# EAGLE design Sequenzer (EAGLE 6.2)
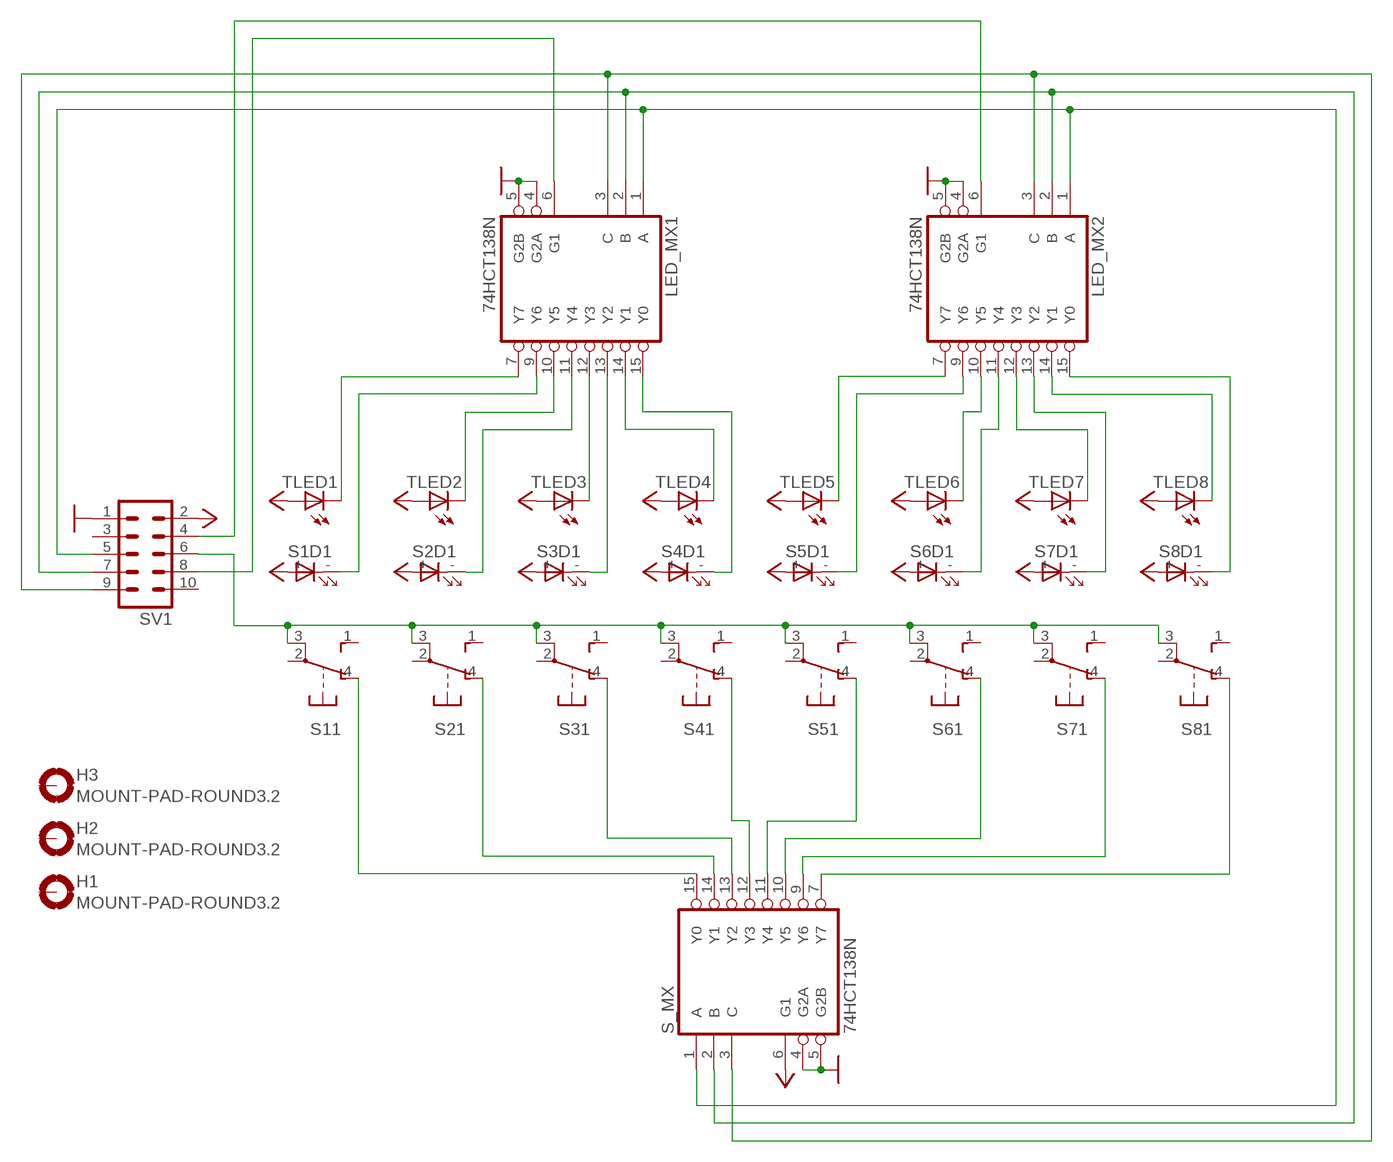
[diagram p0: schematic, sheet 1]

## Parts
H1  MOUNT-PAD-ROUND3.2  [3,2-PAD]
H2  MOUNT-PAD-ROUND3.2  [3,2-PAD]
H3  MOUNT-PAD-ROUND3.2  [3,2-PAD]
LED_MX1  74HCT138N  [DIL16]
LED_MX2  74HCT138N  [DIL16]
S1  SRKL  [SRKL]
S2  SRKL  [SRKL]
S3  SRKL  [SRKL]
S4  SRKL  [SRKL]
S5  SRKL  [SRKL]
S6  SRKL  [SRKL]
S7  SRKL  [SRKL]
S8  SRKL  [SRKL]
S_MX  74HCT138N  [DIL16]
SV1  ML10  [ML10]
TLED1  LED3MM  [LED3MM]
TLED2  LED3MM  [LED3MM]
TLED3  LED3MM  [LED3MM]
TLED4  LED3MM  [LED3MM]
TLED5  LED3MM  [LED3MM]
TLED6  LED3MM  [LED3MM]
TLED7  LED3MM  [LED3MM]
TLED8  LED3MM  [LED3MM]

## Nets
1: LED_MX1.1(A) LED_MX2.1(A) S_MX.1(A) SV1.5
2: LED_MX1.2(B) LED_MX2.2(B) S_MX.2(B) SV1.7
3: LED_MX1.3(C) LED_MX2.3(C) S_MX.3(C) SV1.9
GND: LED_MX1.4(G2A) LED_MX1.5(G2B) LED_MX2.4(G2A) LED_MX2.5(G2B) S_MX.4(G2A) S_MX.5(G2B) SV1.1
MX1EN: LED_MX1.6(G1) SV1.8
MX2EN: LED_MX2.6(G1) SV1.4
N$4: S8.4(1:O) S_MX.7(Y7)
N$5: S7.4(1:O) S_MX.9(Y6)
N$6: S6.4(1:O) S_MX.10(Y5)
N$7: S5.4(1:O) S_MX.11(Y4)
N$8: S4.4(1:O) S_MX.12(Y3)
N$9: S3.4(1:O) S_MX.13(Y2)
N$10: S2.4(1:O) S_MX.14(Y1)
N$11: S1.4(1:O) S_MX.15(Y0)
S_SENSE: S1.3(1:P) S2.3(1:P) S3.3(1:P) S4.3(1:P) S5.3(1:P) S6.3(1:P) S7.3(1:P) S8.3(1:P) SV1.6
SLED: LED_MX1.13(Y2) S3.-(D1:C)
SLED1: LED_MX1.9(Y6) S1.-(D1:C)
SLED2: LED_MX1.11(Y4) S2.-(D1:C)
SLED4: LED_MX1.15(Y0) S4.-(D1:C)
SLED5: LED_MX2.9(Y6) S5.-(D1:C)
SLED6: LED_MX2.11(Y4) S6.-(D1:C)
SLED7: LED_MX2.13(Y2) S7.-(D1:C)
SLED8: LED_MX2.15(Y0) S8.-(D1:C)
TLED1: LED_MX1.7(Y7) TLED1.K(C)
TLED2: LED_MX1.10(Y5) TLED2.K(C)
TLED3: LED_MX1.12(Y3) TLED3.K(C)
TLED4: LED_MX1.14(Y1) TLED4.K(C)
TLED5: LED_MX2.7(Y7) TLED5.K(C)
TLED6: LED_MX2.10(Y5) TLED6.K(C)
TLED7: LED_MX2.12(Y3) TLED7.K(C)
TLED8: LED_MX2.14(Y1) TLED8.K(C)
VCC: S1.+(D1:A) S2.+(D1:A) S3.+(D1:A) S4.+(D1:A) S5.+(D1:A) S6.+(D1:A) S7.+(D1:A) S8.+(D1:A) S_MX.6(G1) SV1.2 TLED1.A TLED2.A TLED3.A TLED4.A TLED5.A TLED6.A TLED7.A TLED8.A
Unconnected: H1.B3,2(MOUNT) H2.B3,2(MOUNT) H3.B3,2(MOUNT) S1.1(1:S) S1.2(1:P) S2.1(1:S) S2.2(1:P) S3.1(1:S) S3.2(1:P) S4.1(1:S) S4.2(1:P) S5.1(1:S) S5.2(1:P) S6.1(1:S) S6.2(1:P) S7.1(1:S) S7.2(1:P) S8.1(1:S) S8.2(1:P) SV1.3 SV1.10

## Power pins joined to a net without a drawn wire
GND: LED_MX1.8(GND) LED_MX2.8(GND) S_MX.8(GND)
VCC: LED_MX1.16(VCC) LED_MX2.16(VCC) S_MX.16(VCC)

## Library data of the parts
H1-H3 = holes:MOUNT-PAD-ROUND: MOUNTING PAD, round
LED_MX1 LED_MX2 S_MX = 74xx-eu:74*138: 3-line to 8-line DECODER/DEMULTIPLEXER
S1-S8 = switch-misc:SRKL: SWITCH
SV1 = con-harting-ml:ML10: HARTING; OC_FARNELL: unknown; OC_NEWARK: unknown
TLED1-TLED8 = led:LED: LED OSRAM: - CHIPLED LG R971, LG N971, LY N971, LG Q971, LY Q971, LO R971, LY R971 LH N974, LH R974 LS Q976, LO Q976, LY Q976 LO Q996 - Hyper CHIPLED LW Q18S LB Q993, LB Q99A, LB R99A - SideLED LS A670, LO A670, LY A670, LG A670, LP A670 LB A673, LV A673, LT A673, LW A673 LH A674 LY A675 LS A676, LA A676, LO A676, LY A676, LW A676 LS A679, LY A679, LG A679 - Hyper Micro SIDELED® LS Y876, LA Y876, LO Y876, LY Y876 LT Y87S - SmartLED LW L88C, LW L88S LB L89C, LB L89S, LG L890 LS L89K, LO L89K, LY L89K LS L896, LA L896, LO L896, LY L896 - TOPLED LS T670, LO T670, LY T670, LG T670, LP T670 LSG T670, LSP T670, LSY T670, LOP T670, LYG T670 LG T671, LOG T671, LSG T671 LB T673, LV T673, LT T673, LW T673 LH T674 LS T676, LA T676, LO T676, LY T676, LB T676, LH T676, LSB T676, LW T676 LB T67C, LV T67C, LT T67C, LS T67K, LO T67K, LY T67K, LW E67C LS E67B, LA E67B, LO E67B, LY E67B, LB E67C, LV E67C, LT E67C LW T67C LS T679, LY T679, LG T679 LS T770, LO T770, LY T770, LG T770, LP T770 LB T773, LV T773, LT T773, LW T773 LH T774 LS E675, LA E675, LY E675, LS T675 LS T776, LA T776, LO T776, LY T776, LB T776 LHGB T686 LT T68C, LB T68C - Hyper Mini TOPLED® LB M676 - Mini TOPLED Santana® LG M470 LS M47K, LO M47K, LY M47K Source: http://www.osram.convergy.de LUXEON: - LUMILED® LXK2-PW12-R00, LXK2-PW12-S00, LXK2-PW14-U00, LXK2-PW14-V00 LXK2-PM12-R00, LXK2-PM12-S00, LXK2-PM14-U00 LXK2-PE12-Q00, LXK2-PE12-R00, LXK2-PE12-S00, LXK2-PE14-T00, LXK2-PE14-U00 LXK2-PB12-K00, LXK2-PB12-L00, LXK2-PB12-M00, LXK2-PB14-N00, LXK2-PB14-P00, LXK2-PB14-Q00 LXK2-PR12-L00, LXK2-PR12-M00, LXK2-PR14-Q00, LXK2-PR14-R00 LXK2-PD12-Q00, LXK2-PD12-R00, LXK2-PD12-S00 LXK2-PH12-R00, LXK2-PH12-S00 LXK2-PL12-P00, LXK2-PL12-Q00, LXK2-PL12-R00 Source: www.luxeon.com KINGBRIGHT: KA-3528ASYC Source: www.kingbright.com

## Board
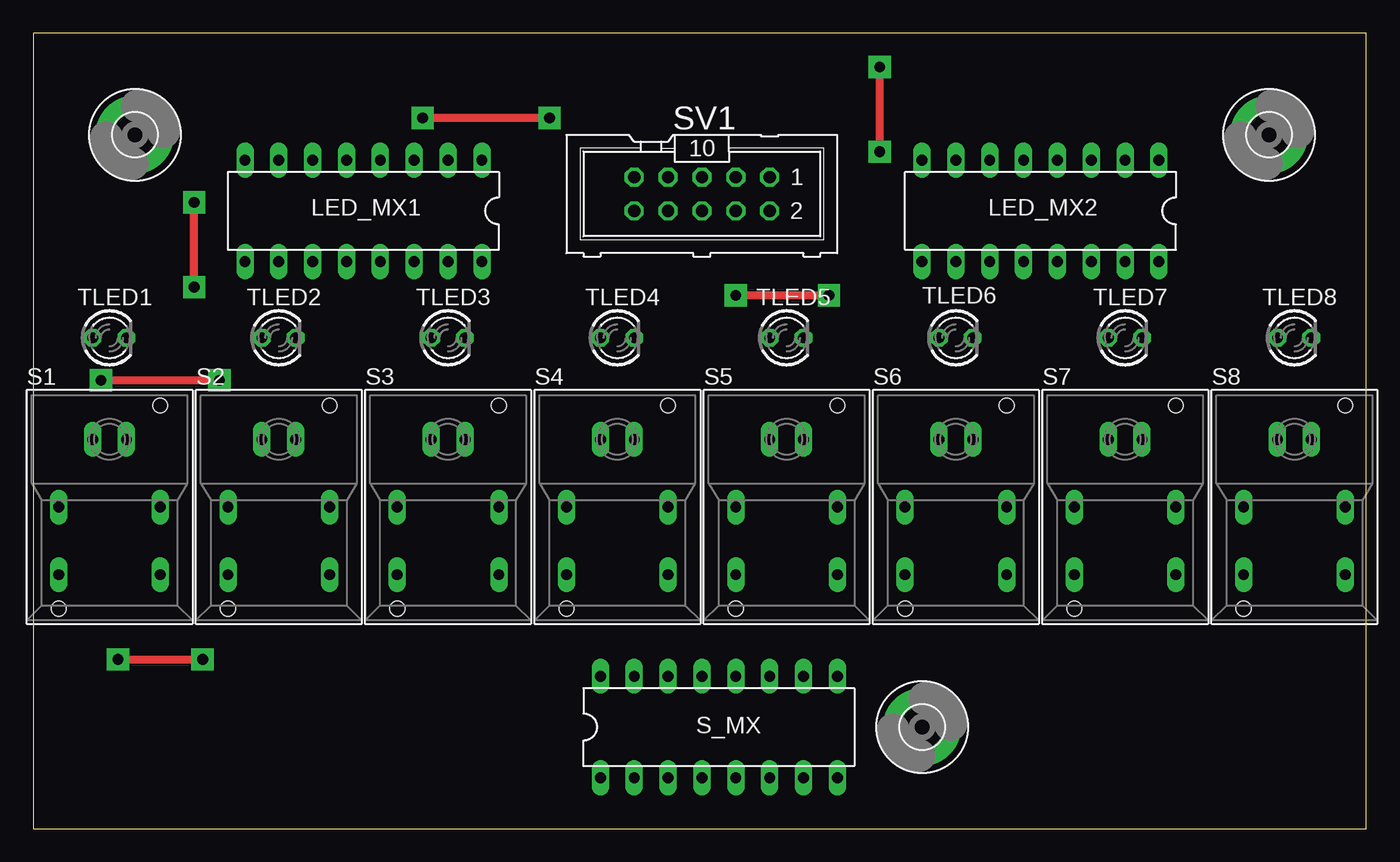
[diagram p1: board, top side]
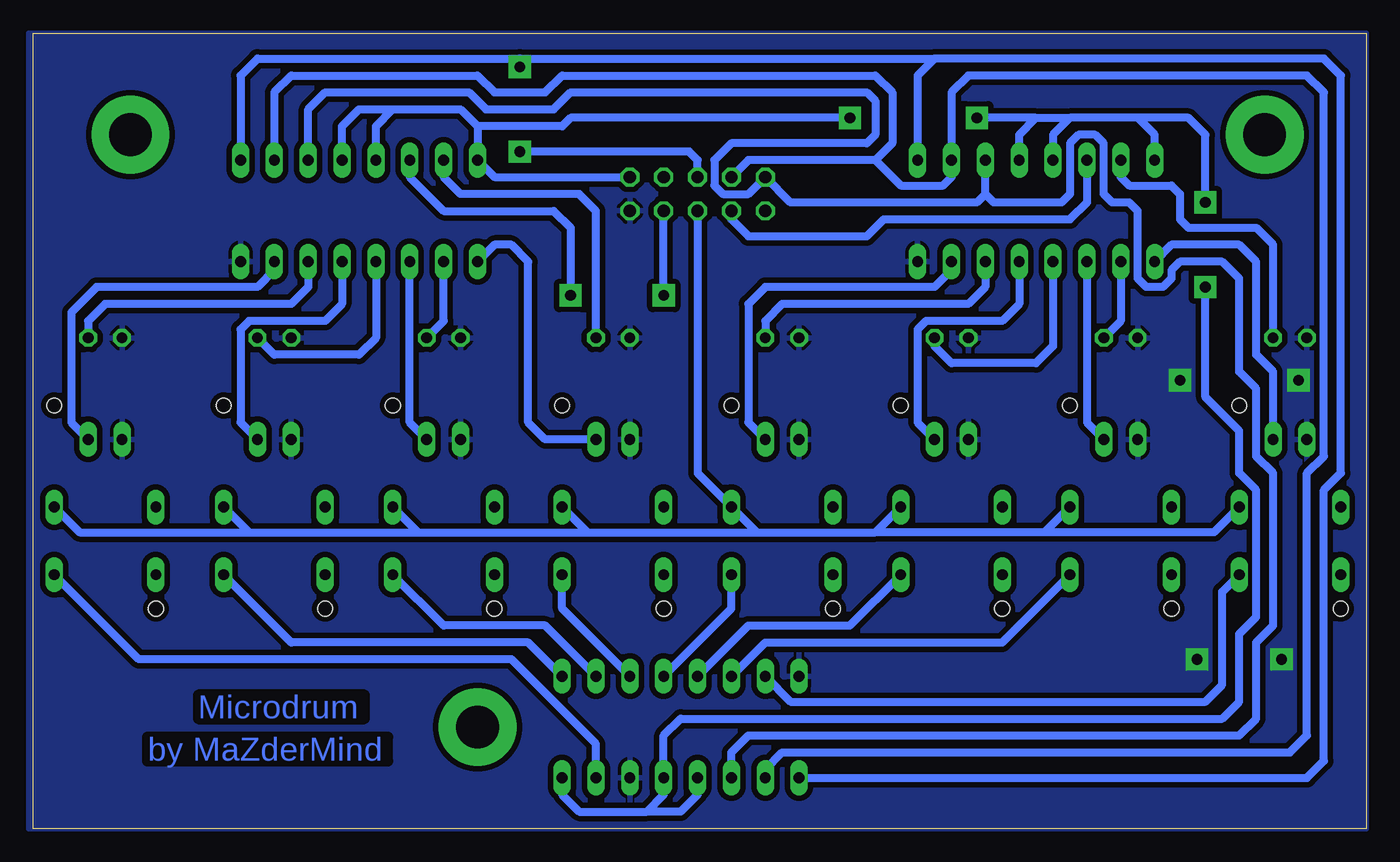
[diagram p2: board, bottom side, seen from below]

Size 100 x 59.68 mm. Coordinates in mm from the lower left corner, seen from the top.
Outline: 0,0 100,0 100,59.68 0,59.68 0,0
Copper layers (1*16): Top 0.035mm / dielectric 1.5mm / Bottom 0.035mm
Design rules: minimum track width 10mil, minimum drill 24mil, track to track 8mil, track to pad 8mil, pad to pad 8mil, via to via 8mil, smd to smd 8mil, copper to edge 0mil, drill to drill 8mil, minimum pad ring 10mil, minimum via ring 8mil, stop-mask expansion 4mil, vias tented up to drill 0mil, thermal gap 10mil

### Footprints (pad centres in the part's own frame; a part is rotated, then mirrored left to right if it is on the bottom)
3,2-PAD = drill 3.2 pad 5.842: B3,2 0,0
DIL16 = drill 0.813 long: 1 -8.89,-3.81; 2 -6.35,-3.81; 3 -3.81,-3.81; 4 -1.27,-3.81; 5 1.27,-3.81; 6 3.81,-3.81; 7 6.35,-3.81; 8 8.89,-3.81; 9 8.89,3.81; 10 6.35,3.81; 11 3.81,3.81; 12 1.27,3.81; 13 -1.27,3.81; 14 -3.81,3.81; 15 -6.35,3.81; 16 -8.89,3.81
SRKL = drill 0.813 long: 1 -3.81,-5.08; 2 -3.81,0; 3 3.81,0; 4 3.81,-5.08; + -1.27,5.08; - 1.27,5.08 | hole 1.118: 3.81,7.62; -3.81,-7.62
ML10 = drill 0.914 octagon: 1 -5.08,-1.27; 2 -5.08,1.27; 3 -2.54,-1.27; 4 -2.54,1.27; 5 0,-1.27; 6 0,1.27; 7 2.54,-1.27; 8 2.54,1.27; 9 5.08,-1.27; 10 5.08,1.27
LED3MM = drill 0.813 octagon: A -1.27,0; K 1.27,0

### Placement (x,y rotation side)
H1  66.67,7.62 0 top
H2  92.71,52.07 0 top
H3  7.62,52.07 0 top
LED_MX1  24.77,46.35 180 top
LED_MX2  75.56,46.35 180 top
S1  5.71,24.13 0 top
S2  18.41,24.13 0 top
S3  31.11,24.13 0 top
S4  43.81,24.13 0 top
S5  56.52,24.13 0 top
S6  69.22,24.13 0 top
S7  81.92,24.13 0 top
S8  94.61,24.13 0 top
S_MX  51.44,7.62 0 top
SV1  50.16,47.62 180 top
TLED1  5.71,36.83 0 top
TLED2  18.41,36.83 0 top
TLED3  31.11,36.83 0 top
TLED4  43.81,36.83 0 top
TLED5  56.52,36.83 0 top
TLED6  69.22,36.83 0 top
TLED7  81.92,36.83 0 top
TLED8  94.61,36.83 0 top

### Tracks (layer width: path | path; a pad name or v marks a point on that pad's centre or on a via)
1  (via drill 0.8 pad 1.68)
  Top 0.61: v63.5,50.8 v63.5,57.15
  Bottom 0.61: S_MX.1 4.45,3.81 3.17,5.08 3.17,25.4 1.91,26.67 1.91,56.52 3.17,57.78 32.38,57.78 | 32.38,57.78 33.66,56.52 LED_MX1.1 | 63.5,57.78 83.19,57.78 84.45,56.52 LED_MX2.1 | 63.5,57.78 32.38,57.78 | SV1.5 50.16,50.16 50.8,50.8 v63.5,50.8 | v63.5,57.15 63.5,57.78
2
  Bottom 0.61: S_MX.2 45.09,4.45 43.81,5.71 5.71,5.71 4.45,6.99 4.45,26.67 3.17,27.94 3.17,55.24 4.45,56.52 29.84,56.52 31.11,55.24 LED_MX1.2 31.11,48.9 31.75,48.26 34.92,48.26 36.83,50.16 | LED_MX2.2 81.92,55.24 80.64,56.52 66.67,56.52 65.41,55.24 61.59,55.24 60.33,56.52 36.83,56.52 35.56,55.24 35.56,51.44 36.83,50.16 | 36.83,50.16 46.35,50.16 SV1.7
3
  Bottom 0.61: S_MX.3 47.62,5.71 46.35,6.99 9.53,6.99 8.26,8.26 8.26,13.97 6.99,15.24 6.99,26.67 8.26,27.94 8.26,33.02 9.53,34.29 9.53,41.27 10.79,42.55 13.97,42.55 14.61,41.91 14.61,41.27 15.24,40.64 16.51,40.64 17.14,41.27 17.14,46.35 17.78,46.99 19.05,46.99 19.68,47.62 19.68,51.44 20.32,52.07 21.59,52.07 22.23,51.44 22.23,47.62 22.86,46.99 27.94,46.99 28.57,47.62 | 28.57,47.62 LED_MX1.3 | 28.57,47.62 29.21,46.99 43.18,46.99 SV1.9 46.35,47.62 48.26,47.62 48.9,48.26 48.9,50.16 47.62,51.44 37.47,51.44 36.83,52.07 36.83,54.61 37.47,55.24 59.69,55.24 60.96,53.98 66.04,53.98 67.31,55.24 78.11,55.24 79.38,53.98 LED_MX2.3
GND  (via drill 0.8 pad 1.68)
  Top 0.61: v12.06,40.64 v12.06,46.99 | v29.21,53.34 v38.73,53.34
  Bottom 0.61: S_MX.8 60.33,2.54 59.05,1.27 53.98,1.27 | 53.98,1.27 52.7,2.54 S_MX.5 52.7,6.99 51.44,8.26 10.79,8.26 9.53,9.53 9.53,14.61 8.26,15.88 8.26,25.4 9.53,26.67 9.53,29.84 12.06,32.38 v12.06,40.64 | S_MX.4 50.16,2.54 51.44,1.27 53.98,1.27 | LED_MX1.8 15.88,52.07 17.14,53.34 | 17.14,53.34 22.23,53.34 | 22.23,53.34 23.5,52.07 LED_MX1.5 | 24.77,53.34 22.23,53.34 | v12.06,46.99 12.06,52.07 13.34,53.34 17.14,53.34 | LED_MX1.4 26.04,52.07 24.77,53.34 | 24.77,53.34 v29.21,53.34 | v38.73,53.34 59.69,53.34 60.33,52.7 66.67,52.7 | 66.67,52.7 67.94,53.98 73.03,53.98 | 66.67,52.7 LED_MX2.8 65.41,48.9 SV1.1 | LED_MX2.5 74.3,52.7 73.03,53.98 | LED_MX2.4 76.83,52.7 75.56,53.98 73.03,53.98
MX1EN
  Bottom 0.61: SV1.8 47.62,45.72 46.35,44.45 37.47,44.45 36.2,45.72 22.23,45.72 20.95,46.99 LED_MX1.6
MX2EN  (via drill 0.8 pad 1.68)
  Top 0.61: v59.69,40.01 v52.7,40.01
  Bottom 0.61: LED_MX2.6 71.75,48.9 69.22,46.35 60.96,46.35 59.69,45.09 v59.69,40.01 | v52.7,40.01 SV1.4
N$4
  Bottom 0.61: S_MX.7 57.78,6.35 64.14,12.7 92.08,12.7 S8.4
N$5
  Bottom 0.61: S_MX.9 62.87,13.97 80.64,13.97 S7.4
N$6
  Bottom 0.61: S_MX.10 61.59,15.24 69.22,15.24 S6.4
N$7
  Bottom 0.61: S_MX.11 60.33,16.51 S5.4
N$8
  Bottom 0.61: S_MX.12 47.62,16.51 S4.4
N$9
  Bottom 0.61: S_MX.13 46.35,15.24 38.73,15.24 S3.4
N$10
  Bottom 0.61: S_MX.14 45.09,13.97 27.3,13.97 S2.4
N$11
  Bottom 0.61: S_MX.15 43.18,9.53 12.06,9.53 10.79,10.79 10.79,17.78 S1.4
S_SENSE
  Bottom 0.61: S1.3 11.43,22.23 24.13,22.23 | S2.3 24.13,22.23 | 24.13,22.23 36.83,22.23 | 36.83,22.23 S3.3 | S8.3 96.52,22.23 83.82,22.23 | S7.3 83.82,22.23 | 83.82,22.23 71.12,22.23 | S6.3 71.12,22.23 | 71.12,22.23 58.42,22.23 | S5.3 58.42,22.23 | 58.42,22.23 45.72,22.23 | 45.72,22.23 S4.3 50.16,26.67 SV1.6 | 45.72,22.23 36.83,22.23
SLED
  Bottom 0.61: LED_MX1.13 26.04,39.37 27.3,38.1 33.02,38.1 33.66,37.47 33.66,30.48 S3.-
SLED1
  Bottom 0.61: S1.- 6.99,34.29 8.26,35.56 8.26,42.55 9.53,43.81 14.61,43.81 LED_MX1.9
SLED2
  Bottom 0.61: LED_MX1.11 20.95,30.48 S2.-
SLED4
  Bottom 0.61: LED_MX1.15 31.11,41.91 32.38,40.64 45.09,40.64 46.35,39.37 46.35,30.48 S4.-
SLED5
  Bottom 0.61: S5.- 61.59,29.21 62.87,30.48 62.87,42.55 64.14,43.81 65.41,43.81 LED_MX2.9
SLED6
  Bottom 0.61: S6.- 71.75,30.48 LED_MX2.11
SLED7
  Bottom 0.61: LED_MX2.13 76.83,39.37 78.11,38.1 83.82,38.1 84.45,37.47 84.45,30.48 S7.-
SLED8
  Bottom 0.61: LED_MX2.15 81.92,41.91 83.19,40.64 95.25,40.64 97.16,38.73 97.16,30.48 S8.-
TLED1
  Bottom 0.61: TLED1.K 6.99,43.81 8.26,45.09 13.34,45.09 13.97,45.72 13.97,47.62 14.61,48.26 17.78,48.26 18.41,48.9 LED_MX1.7
TLED2
  Bottom 0.61: LED_MX1.10 18.41,38.1 TLED2.K
TLED3
  Bottom 0.61: LED_MX1.12 23.5,36.2 24.77,34.92 31.11,34.92 32.38,36.2 TLED3.K
TLED4
  Bottom 0.61: LED_MX1.14 28.57,40.64 29.84,39.37 43.81,39.37 45.09,38.1 TLED4.K
TLED5
  Bottom 0.61: TLED5.K 57.78,46.35 59.05,47.62 67.94,47.62 69.22,48.9 LED_MX2.7
TLED6
  Bottom 0.61: TLED6.K 69.22,38.1 LED_MX2.10
TLED7
  Bottom 0.61: LED_MX2.12 74.3,36.83 75.56,35.56 81.92,35.56 TLED7.K
TLED8
  Bottom 0.61: LED_MX2.14 79.38,40.64 80.64,39.37 94.61,39.37 95.89,38.1 TLED8.K
VCC  (via drill 0.8 pad 1.68)
  Top 0.61: v6.35,12.7 v12.7,12.7 | v5.08,33.66 v13.97,33.66
  pour Bottom (isolate 0.406): 0,0 100.33,0 100.33,59.69 0,59.69

### Text on the board
Bottom: Microdrum | by MaZderMind